# Altium project BenchSignalGenerator.PrjPcb (part 1 of 3)
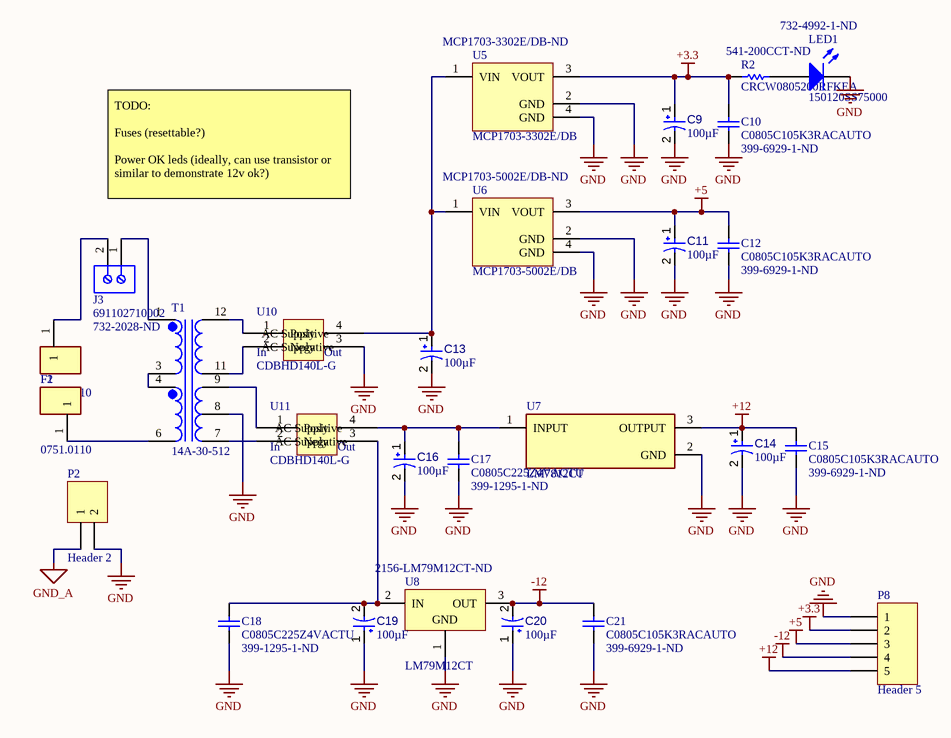
[diagram p0: Power.SchDoc]
4 sheets, 75 parts. Net scope: flat (ports and power ports of the same name join across sheets).
Board file: BenchSignalGenerator.PcbDoc
Sheets:
  Power.SchDoc
  AD9834.SchDoc
  MCU.SchDoc
  InputOutput.SchDoc

## Sheet Power.SchDoc
size A4

### Parts
C9  value 100µF  [CAPPR65-500-1600X1000X1700]  (hidden comment: ECA-2AM101)
C10  C0805C105K3RACAUTO  Supplier Part Number 1: 399-6929-1-ND  [CAPC2013X140X50ML20T25]
C11  value 100µF  [CAPPR65-500-1600X1000X1700]  (hidden comment: ECA-2AM101)
C12  C0805C105K3RACAUTO  Supplier Part Number 1: 399-6929-1-ND  [CAPC2013X140X50ML20T25]
C13  value 100µF  [CAPPR65-500-1600X1000X1700]  (hidden comment: ECA-2AM101)
C14  value 100µF  [CAPPR65-500-1600X1000X1700]  (hidden comment: ECA-2AM101)
C15  C0805C105K3RACAUTO  Supplier Part Number 1: 399-6929-1-ND  [CAPC2013X140X50ML20T25]
C16  value 100µF  [CAPPR65-500-1600X1000X1700]  (hidden comment: ECA-2AM101)
C17  C0805C225Z4VACTU  Supplier Part Number 1: 399-1295-1-ND  [CAPC2013X100X50NL20T25]
C18  C0805C225Z4VACTU  Supplier Part Number 1: 399-1295-1-ND  [CAPC2013X100X50NL20T25]
C19  value 100µF  [CAPPR65-500-1600X1000X1700]  (hidden comment: ECA-2AM101)
C20  value 100µF  [CAPPR65-500-1600X1000X1700]  (hidden comment: ECA-2AM101)
C21  C0805C105K3RACAUTO  Supplier Part Number 1: 399-6929-1-ND  [CAPC2013X140X50ML20T25]
F1  0751.0110  [FP-0751_0110-MFG]
F2  0751.0110  [FP-0751_0110-MFG]
J3  691102710002  Supplier Part Number 1: 732-2028-ND  [691102710002]
LED1  150120SS75000  Supplier Part Number 1: 732-4992-1-ND  [1206_A]
P2  Header 2  [HDR1X2]
P8  Header 5  [HDR1X5]
R2  CRCW0805200RFKEA  Supplier Part Number 1: 541-200CCT-ND  [RESC2013X50X30NL20T20]
T1  14A-30-512  [XFMR_14A-30-512]
U5  MCP1703-3302E/DB  Supplier Part Number 1: MCP1703-3302E/DB-ND  [SOT-223-DB3_M]
U6  MCP1703-5002E/DB  Supplier Part Number 1: MCP1703-5002E/DB-ND  [SOT-223-DB3_N]
U7  LM7812CT  [FP-TO220B03-MFG]
U8  LM79M12CT  Supplier Part Number 1: 2156-LM79M12CT-ND  [NDE0003A]
U10  CDBHD140L-G  [SOP270P700X290-4N]
U11  CDBHD140L-G  [SOP270P700X290-4N]

### Nets
+3.3: C9.1 C10.2 P8.2 R2.1 U5.3(VOUT)
+5: C11.1 C12.2 P8.3 U6.3(VOUT)
+12: C14.1 C15.2 P8.5 U7.3(OUTPUT)
-12: C20.2 C21.2 P8.4 U8.3(OUT)
GND: C9.2 C10.1 C11.2 C12.1 C13.2 C14.2 C15.1 C16.2 C17.1 C18.1 C19.1 C20.1 C21.1 LED1.1(K) P2.2 P8.1 T1.8 U5.2(GND) U5.4(GND) U6.2(GND) U6.4(GND) U7.2(GND) U8.1(GND) U10.3(AC_Supply)
GND_A: P2.1
NetC13_1: C13.1 U5.1(VIN) U6.1(VIN) U10.4(AC_Supply)
NetC16_1: C16.1 C17.2 U7.1(INPUT) U11.4(AC_Supply)
NetC18_2: C18.2 C19.2 U8.2(IN) U11.3(AC_Supply)
NetF1_1: F1.1 T1.6
NetF2_1: F2.1 J3.2
NetJ3_1: J3.1 T1.1
NetLED1_2: LED1.2(A) R2.2
NetT1_3: T1.3 T1.4
NetT1_7: T1.7 U11.2(Negative)
NetT1_9: T1.9 U11.1(Positive)
NetT1_11: T1.11 U10.2(Negative)
NetT1_12: T1.12 U10.1(Positive)

### Notes on the sheet
- TODO:
  Fuses (resettable?)
  Power OK leds (ideally, can use transistor or similar to demonstrate 12v ok?)
- (in symbol CMP-019-00049-1) In; Out

### Library data of the parts
C9 C11 C13 C14 C16 C19 C20 = CMP-001-00034-5: Aluminum Electrolytic Capacitor, 100 uF, +/- 20%, 100 V, -40 to 85 degC, 2-Pin THD, RoHS, Bulk; Manufacturer: Panasonic; Voltage Rating: 100V; Ripple Current (AC): 350mA; Mounting Technology: TH; RoHS Compliant: True; Package Reference: CAPPR65-500-1600X1000X1700; Lead Pitch: 5mm; Manufacturer URL: http://www.panasonic.com/; Min Operating Temperature: -40°C; Package Quantity: 200; Capacitor Type: Electrolytic; Diameter: 10mm; Packaging: Bulk; Datasheet URL: https://industrial.panasonic.com/cdbs/www-data/pdf/RDF0000/ABA0000C1047.pdf; Max Operating Temperature: 85°C; Pins: 2; Case/Package: Radial; Package Description: 2-Pin Through Hole Device, Dia 10 mm, Body Length 16 mm; Ripple Current: 350mA; Tolerance: 20%; Datasheet Version: Mar-16
C10 C12 C15 C21 = CMP-2007-03233-1: Manufacturer: Kemet; Dielectric Material: Ceramic; Capacitance: 1uF; Tolerance: 10%; Dielectric: X7R; Voltage Rating (DC): 25V; Part Number: C0805C105K3RACAUTO; Supplier 1: Digi-Key; Manufacturer Part Number: C0805C105K3RACAUTO; RoHS: Yes; Category: Ceramic Capacitors; Stock 1: 71727; Pricing 1: 1=0.18000, 10=0.12100, 50=0.07280, 100=0.06140, 500=0.04204, 1000=0.03719 (USD); Mount: Surface Mount; Case/Package: 0805; Case Code (Metric): 2012; Case Code (Imperial): 0805; Min Operating Temperature: -55°C; Max Operating Temperature: 125°C; Packaging: Cut Tape; Voltage Rating: 25V; Package Quantity: 1; Length: 2mm; Height: 1.25mm; Width: 0.049inch; Thickness: 0.055inch; Depth: 1.25mm; Ratings: AEC-Q200; Radiation Hardening: No; REACH SVHC: No SVHC; ComponentLink1URL: https://datasheet.ciiva.com/6074/1732735-6074357.pdf?src-supplier=Farnell; ComponentLink1Description: https://datasheet.ciiva.com/6074/1732735-6074357.pdf?src-supplier=Farnell; ComponentLink2URL: https://datasheet.ciiva.com/7842/1732735-7842186.pdf?src-supplier=Element14; ComponentLink2Description: https://datasheet.ciiva.com/7842/1732735-7842186.pdf?src-supplier=Element14
C17 C18 = CMP-2007-03689-1: Manufacturer: Kemet; Dielectric Material: Ceramic; Capacitance: 2.2uF; Tolerance: 80%; Voltage Rating (DC): 16V; Dielectric: Y5V; Part Number: C0805C225Z4VACTU; Supplier 1: Digi-Key; Manufacturer Part Number: C0805C225Z4VACTU; RoHS: Yes; Category: Ceramic Capacitors; Stock 1: 131695; Pricing 1: 1=0.20000, 10=0.13600, 50=0.08160, 100=0.06900, 500=0.04720, 1000=0.04175 (USD); Mount: Surface Mount; Case/Package: 0805; Case Code (Imperial): 0805; Case Code (Metric): 2012; Min Operating Temperature: -30°C; Max Operating Temperature: 85°C; Packaging: Tape and Reel; Voltage Rating: 16V; Termination: SMD/SMT; Package Quantity: 1; Voltage: 16V; Length: 2mm; Height: 0.9mm; Depth: 1.25mm; Width: 0.049inch; Thickness: 0.055inch; Lead Pitch: 0.75mm; Radiation Hardening: No; Lead Free: Lead Free; REACH SVHC: No SVHC; ComponentLink1URL: https://datasheet.ciiva.com/7842/1698780-7842295.pdf?src-supplier=Element14; ComponentLink1Description: https://datasheet.ciiva.com/7842/1698780-7842295.pdf?src-supplier=Element14; ComponentLink2URL: https://datasheet.ciiva.com/7842/1698780-7842296.pdf?src-supplier=Element14; ComponentLink2Description: https://datasheet.ciiva.com/7842/1698780-7842296.pdf?src-supplier=Element14; ComponentLink3URL: https://datasheet.ciiva.com/18102/getdatasheetpartid-63401-18102155.pdf?src-supplier=Verical; ComponentLink3Description: https://datasheet.ciiva.com/18102/getdatasheetpartid-63401-18102155.pdf?src-supplier=Verical
F1 F2 = CMP-26292-000006-1: FUSE CLIP CARTRIDGE 10A PCB; Manufacturer: Schurter; Conn Orientation: Horizontal; Voltage Rating Ac: 500V; Number Of Fuses: 1; ComponentLink2Description: Datasheet; ComponentLink2URL: https://us.schurter.com/bundles/snceschurter/epim/_ProdPool_/newDS/en/typ_OG__Clip__5x20.pdf; Package: 0; Device Class L1: Circuit Protection; Lead Free: Yes; RoHS: TRUE; Voltage Rating Dc: 500V; Device Class L3: unset; Ambient Temperature Range Low: -40°C; Manufacturer Part Number: 0751.0110; Device Class L2: Fuse Holders; Octopart: https://octopart.com/0751.0110-schurter-19402; Height: 8.9mm; Digikey Description: FUSE CLIP CARTRIDGE 10A PCB; Ambient Temperature Range High: +85°C; Category: Fuse; Fuse Current: 10A; Automotive: No
J3 = CMP-1502-03258-1: Series 102 - 5.00 mm Horizontal Entry Modular with Pressure Clamp WR-TBL, 2 pin; Manufacturer: Wurth Elektronik; Pin Number: 2; Pitch: 5.00mm; Plating: Steel; Current Rating: 15A; Voltage Rating: 300V; Number of Levels: 1; Wire/Cable Gauge: 22AWG; Wire Gauge (Min): 14AWG; Stripping Length: -6mm; Manufacturer URL: http://www.we-online.de; Mounting Technology: THT; Publisher: WurthElektronik; Packaging: Box; Package Reference: 691102710002; Datasheet URL: http://katalog.we-online.de/em/datasheet/6911027100xx.pdf; Operating Temperature: -40to105degC; Part Number: 691102710002; Supplier 1: Digi-Key; Manufacturer Part Number: 691102710002; RoHS: Yes; Category: Terminal Blocks; Stock 1: 832; Pricing 1: 1=0.69000, 10=0.61600, 50=0.53200, 100=0.48000 (USD); Mount: Through Hole; Contact Material: Brass; Color: Blue; Contact Plating: Tin; Housing Material: Nylon; Min Operating Temperature: -40°C; Max Operating Temperature: 105°C; Termination: Screw; Number of Contacts: 2; Package Quantity: 900; Number of Positions Per Level: 2; Current: 15A; Voltage: 300V; Length: 7.5mm; Height: 13.4mm; Width: 11.2mm; Wire Gauge (Max): 22AWG; REACH SVHC: Unknown; ComponentLink1URL: https://datasheet.ciiva.com/824/6911027100xx-824045.pdf?src-supplier=Digi-Key; ComponentLink1Description: https://datasheet.ciiva.com/824/6911027100xx-824045.pdf?src-supplier=Digi-Key; ComponentLink2URL: https://datasheet.ciiva.com/48686/001088592-da-01-en-wr-tbl-terminal-block102-691102710002-48686823.pdf?src-supplier=Conrad; ComponentLink2Description: https://datasheet.ciiva.com/48686/001088592-da-01-en-wr-tbl-terminal-block102-691102710002-48686823.pdf?src-supplier=Conrad
LED1 = CMP-1426-00017-1: SMD mono-color Chip LED, WL-SMCW, Super Red; Manufacturer: Wuerth Elektronik; Viewing Angle: 140°; Lens Style: Clear,Rectangular; Luminous Intensity: 60mcd; Forward Current: 30mA; Forward Voltage: 1.9V; Wavelength: 630nm; Test Current: 20mA; ComponentLink1URL: http://www.we-online.com; PackageReference: 1206_A; ComponentLink2Description: Datasheet; ComponentLink1Description: Manufacturer URL; ComponentLink2URL: http://katalog.we-online.com/led/datasheet/150120SS75000.pdf; Color: Super Red; PartNumber: 150120SS75000; Supplier 1: Digi-Key; Manufacturer Part Number: 150120SS75000; RoHS: Yes; Category: LEDs; Stock 1: 4278; Pricing 1: 1=0.21000, 50=0.19800, 100=0.17100, 500=0.14800 (USD); Mount: Surface Mount; Case/Package: 1206; Case Code (Metric): 3216; Case Code (Imperial): 1206; Min Operating Temperature: -40°C; Max Operating Temperature: 85°C; Package Quantity: 3000; Packaging: Tape and Reel; Dominant Wavelength: 630nm; Length: 3.2mm; Height: 0.68mm; Width: 1.6mm; REACH SVHC: Unknown; ComponentLink3URL: https://datasheet.ciiva.com/29561/150120ss75000-29561862.pdf?src-supplier=Digi-Key; ComponentLink3Description: https://datasheet.ciiva.com/29561/150120ss75000-29561862.pdf?src-supplier=Digi-Key; ComponentLink4URL: https://datasheet.ciiva.com/29279/759443-da-01-en-chipled-1206-w-kl-s-rot-150120ss75000-29279053.pdf?src-supplier=Conrad; ComponentLink4Description: https://datasheet.ciiva.com/29279/759443-da-01-en-chipled-1206-w-kl-s-rot-150120ss75000-29279053.pdf?src-supplier=Conrad; ComponentLink5URL: https://datasheet.ciiva.com/29561/150120ss75000-29561863.pdf?src-supplier=Digi-Key; ComponentLink5Description: https://datasheet.ciiva.com/29561/150120ss75000-29561863.pdf?src-supplier=Digi-Key; ComponentLink6URL: https://datasheet.ciiva.com/48430/150120ss75000-eng-tds-48430055.pdf?src-supplier=Distrelec; ComponentLink6Description: https://datasheet.ciiva.com/48430/150120ss75000-eng-tds-48430055.pdf?src-supplier=Distrelec; ComponentLink7URL: https://datasheet.ciiva.com/29561/150120ss75000-29561864.pdf?src-supplier=Digi-Key; ComponentLink7Description: https://datasheet.ciiva.com/29561/150120ss75000-29561864.pdf?src-supplier=Digi-Key
P2 = Header 2: Header, 2-Pin; LatestRevisionDate: 17-Jul-2002; LatestRevisionNote: Re-released for DXP Platform.; Publisher: Altium Limited
P8 = Header 5: Header, 5-Pin; LatestRevisionDate: 17-Jul-2002; LatestRevisionNote: Re-released for DXP Platform.; Publisher: Altium Limited
R2 = CMP-2001-03663-1: Manufacturer: Vishay Dale; Resistance: 200R; Tolerance: 1%; Temperature Coefficient: 100ppm/°C; Power Rating: 125mW; Voltage Rating: 150V; Part Number: CRCW0805200RFKEA; Supplier 1: Digi-Key; Manufacturer Part Number: CRCW0805200RFKEA; RoHS: Yes; Category: Chip SMD Resistors; Stock 1: 97163; Pricing 1: 1=0.10000, 10=0.06000, 100=0.02450, 1000=0.01102, 2500=0.00957 (USD); Mount: Surface Mount; Case/Package: 0805; Number of Pins: 2; Weight: 0.000194oz; Case Code (Metric): 2012; Case Code (Imperial): 0805; Contact Plating: Tin; Min Operating Temperature: -55°C; Max Operating Temperature: 155°C; Packaging: Tape and Reel; Termination: SMD/SMT; Composition: Thick Film; Voltage Rating (DC): 150V; Package Quantity: 10; Number of Terminations: 2; Military Standard: Not; Max Power Dissipation: 125mW; Features: Automotive AEC-Q200; Working Voltage: 150V; Length: 2mm; Height: 0.45mm; Width: 0.049inch; Depth: 1.25mm; Radiation Hardening: No; REACH SVHC: Unknown; Lead Free: Lead Free; ComponentLink1URL: https://datasheet.ciiva.com/11809/0900766b80d98b26-11809981.pdf?src-supplier=RSComponents; ComponentLink1Description: https://datasheet.ciiva.com/11809/0900766b80d98b26-11809981.pdf?src-supplier=RSComponents; ComponentLink2URL: https://datasheet.ciiva.com/2467/dcrcwe3-2467524.pdf?src-supplier=Digi-Key; ComponentLink2Description: https://datasheet.ciiva.com/2467/dcrcwe3-2467524.pdf?src-supplier=Digi-Key; ComponentLink3URL: https://datasheet.ciiva.com/2467/dcrcwe3-2467525.pdf?src-supplier=Digi-Key; ComponentLink3Description: https://datasheet.ciiva.com/2467/dcrcwe3-2467525.pdf?src-supplier=Digi-Key; ComponentLink4URL: https://datasheet.ciiva.com/17167/dcrcwe3-17167157.pdf?src-supplier=Avnet+Europe; ComponentLink4Description: https://datasheet.ciiva.com/17167/dcrcwe3-17167157.pdf?src-supplier=Avnet+Europe; ComponentLink5URL: https://datasheet.ciiva.com/2467/dcrcwe3-2467526.pdf?src-supplier=Digi-Key; ComponentLink5Description: https://datasheet.ciiva.com/2467/dcrcwe3-2467526.pdf?src-supplier=Digi-Key; ComponentLink6URL: https://datasheet.ciiva.com/7673/1697337-7673478.pdf?src-supplier=Element14; ComponentLink6Description: https://datasheet.ciiva.com/7673/1697337-7673478.pdf?src-supplier=Element14; ComponentLink7URL: https://datasheet.ciiva.com/16755/70201119-16755607.pdf?src-supplier=Allied+Electronics; ComponentLink7Description: https://datasheet.ciiva.com/16755/70201119-16755607.pdf?src-supplier=Allied+Electronics; ComponentLink8URL: https://datasheet.ciiva.com/7673/1697337-7673336.pdf?src-supplier=Element14; ComponentLink8Description: https://datasheet.ciiva.com/7673/1697337-7673336.pdf?src-supplier=Element14; ComponentLink9URL: https://datasheet.ciiva.com/5542/dcrcwe3-109170-5542762.pdf?src-supplier=Mouser; ComponentLink9Description: https://datasheet.ciiva.com/5542/dcrcwe3-109170-5542762.pdf?src-supplier=Mouser; ComponentLink10URL: https://datasheet.ciiva.com/26317/fld-crcw-e3-data-en-26317339.pdf?src-supplier=Distrelec; ComponentLink10Description: https://datasheet.ciiva.com/26317/fld-crcw-e3-data-en-26317339.pdf?src-supplier=Distrelec; ComponentLink11URL: https://datasheet.ciiva.com/3258/dcrcwe3-3258302.pdf?src-supplier=Avnet; ComponentLink11Description: https://datasheet.ciiva.com/3258/dcrcwe3-3258302.pdf?src-supplier=Avnet; ComponentLink12URL: https://datasheet.ciiva.com/16199/dcrcwe3-16199471.pdf?src-supplier=Future+Electronics; ComponentLink12Description: https://datasheet.ciiva.com/16199/dcrcwe3-16199471.pdf?src-supplier=Future+Electronics; ComponentLink13URL: https://datasheet.ciiva.com/16786/70201119-16786975.pdf?src-supplier=Allied+Electronics; ComponentLink13Description: https://datasheet.ciiva.com/16786/70201119-16786975.pdf?src-supplier=Allied+Electronics
T1 = 14A-30-512: International One-4-All Triple Output Transformer; Value: *
U5 = CMP-0136-00514-1: 250 mA, 16V, Low Quiescent Current LDO Regulator, 3-Pin SOT-223, Extended Temperature; Manufacturer: Microchip; Min Input Voltage: 2.7V; Output Voltage: 3.3V; Dropout Voltage: 525mV; Output Current: 250mA; Output Type: Fixed; Number of Outputs: 1; Quiescent Current: 5uA; Polarity: Positive; Accuracy: 2%; Input Bias Current: 2uA; PackageReference: SOT-223-DB3; DatasheetVersion: revD, Sep-2009; PackageVersion: revBB, Aug-2009; PackageDescription: 3-Lead Plastic Small Outline Transistor (DB) [SOT-223]; Supplier 1: Digi-Key; Manufacturer Part Number: MCP1703-3302E/DB; RoHS: Yes; Category: Voltage Regulators - Linear; Stock 1: 2370; Pricing 1: 1=0.62000, 25=0.52000, 100=0.47000 (USD); Mount: Surface Mount; Case/Package: SOT-223; Number of Pins: 3; Contact Plating: Tin,Matte; Min Operating Temperature: -40°C; Max Operating Temperature: 125°C; Packaging: Rail/Tube; Max Input Voltage: 16V; Max Output Current: 250mA; Min Output Voltage: 3.3V; Package Quantity: 78; Output Voltage Accuracy: 2%; Nominal Output Voltage: 3.3V; Length: 6.5mm; Height: 1.6mm; Width: 3.5mm; Radiation Hardening: No; Lead Free: Lead Free; REACH SVHC: No SVHC; ComponentLink1URL: https://datasheet.ciiva.com/3224/jp530937-3224135.pdf?src-supplier=Avnet; ComponentLink1Description: https://datasheet.ciiva.com/3224/jp530937-3224135.pdf?src-supplier=Avnet; ComponentLink2URL: https://datasheet.ciiva.com/8041/22049f-8041354.pdf?src-supplier=Element14; ComponentLink2Description: https://datasheet.ciiva.com/8041/22049f-8041354.pdf?src-supplier=Element14; ComponentLink3URL: https://datasheet.ciiva.com/15200/getdatasheetpartid-771601-15200250.pdf?src-supplier=Verical; ComponentLink3Description: https://datasheet.ciiva.com/15200/getdatasheetpartid-771601-15200250.pdf?src-supplier=Verical; ComponentLink4URL: https://datasheet.ciiva.com/2057/22049f-2057211.pdf?src-supplier=Digi-Key; ComponentLink4Description: https://datasheet.ciiva.com/2057/22049f-2057211.pdf?src-supplier=Digi-Key; ComponentLink5URL: https://datasheet.ciiva.com/29305/651421-da-01-en-ic-reg-ld-mcp1703-3302e-db-sot-223-3-mcp-29305285.pdf?src-supplier=Conrad; ComponentLink5Description: https://datasheet.ciiva.com/29305/651421-da-01-en-ic-reg-ld-mcp1703-3302e-db-sot-223-3-mcp-29305285.pdf?src-supplier=Conrad
U6 = CMP-0136-00522-1: 250 mA, 16V, Low Quiescent Current LDO Regulator, 3-Pin SOT-223, Extended Temperature; Manufacturer: Microchip; Output Voltage: 5V; Min Input Voltage: 2.7V; Dropout Voltage: 330mV; Output Current: 250mA; Output Type: Fixed; Number of Outputs: 1; Polarity: Positive; Quiescent Current: 5uA; Accuracy: 2%; Input Bias Current: 2uA; PackageReference: SOT-223-DB3; PackageVersion: revBB, Aug-2009; DatasheetVersion: revD, Sep-2009; PackageDescription: 3-Lead Plastic Small Outline Transistor (DB) [SOT-223]; Supplier 1: Digi-Key; Manufacturer Part Number: MCP1703-5002E/DB; RoHS: Yes; Category: Voltage Regulators - Linear; Stock 1: 5236; Pricing 1: 1=0.62000, 25=0.52000, 100=0.47000 (USD); Mount: Surface Mount; Case/Package: SOT-223; Number of Pins: 3; Min Operating Temperature: -40°C; Max Operating Temperature: 125°C; Packaging: Rail/Tube; Max Input Voltage: 16V; Max Output Current: 250mA; Min Output Voltage: 5V; Package Quantity: 78; Output Voltage Accuracy: 2%; Nominal Output Voltage: 5V; Length: 6.5mm; Height: 1.6mm; Width: 3.5mm; Radiation Hardening: No; Lead Free: Lead Free; REACH SVHC: No SVHC; ComponentLink1URL: https://datasheet.ciiva.com/41458/001085888-da-01-en-ic-reg-ld-mcp1703-5002e-db-sot-223-3-mcp-41458871.pdf?src-supplier=Conrad; ComponentLink1Description: https://datasheet.ciiva.com/41458/001085888-da-01-en-ic-reg-ld-mcp1703-5002e-db-sot-223-3-mcp-41458871.pdf?src-supplier=Conrad; ComponentLink2URL: https://datasheet.ciiva.com/2041/22049f-2041046.pdf?src-supplier=Digi-Key; ComponentLink2Description: https://datasheet.ciiva.com/2041/22049f-2041046.pdf?src-supplier=Digi-Key; ComponentLink3URL: https://datasheet.ciiva.com/3224/jp530937-3224136.pdf?src-supplier=Avnet; ComponentLink3Description: https://datasheet.ciiva.com/3224/jp530937-3224136.pdf?src-supplier=Avnet; ComponentLink4URL: https://datasheet.ciiva.com/8041/22049f-8041355.pdf?src-supplier=Element14; ComponentLink4Description: https://datasheet.ciiva.com/8041/22049f-8041355.pdf?src-supplier=Element14; ComponentLink5URL: https://datasheet.ciiva.com/15200/getdatasheetpartid-626576-15200251.pdf?src-supplier=Verical; ComponentLink5Description: https://datasheet.ciiva.com/15200/getdatasheetpartid-626576-15200251.pdf?src-supplier=Verical; ComponentLink6URL: https://datasheet.ciiva.com/16373/filehandler-aspxddocname-en530937-16373582.pdf?src-supplier=Future+Electronics; ComponentLink6Description: https://datasheet.ciiva.com/16373/filehandler-aspxddocname-en530937-16373582.pdf?src-supplier=Future+Electronics; ComponentLink7URL: https://datasheet.ciiva.com/22629/22049f-22629247.pdf?src-supplier=Farnell; ComponentLink7Description: https://datasheet.ciiva.com/22629/22049f-22629247.pdf?src-supplier=Farnell
U7 = CMP-07128-000015-1: IC REG LINEAR 12V 1A TO220-3; Obsolete Part: true; Manufacturer: ON Semiconductor; Nominal Supply Current: 5.1mA; Output Type: Fixed; Dropout Voltage: 2V; Max Supply Voltage: 35V; Accuracy Percentage: 4%; Standoff Height: 2.7mm; Number Of Outputs: 1; Octopart: https://octopart.com/lm7812ct-on+semiconductor-14383031; Output Current: 1A; ComponentLink2Description: Datasheet; Device Class L1: Integrated Circuits (ICs); Device Class L2: Power Management ICs; Temperature Range Low: -40°C; Category: IC; Package: TO220B03; Device Class L3: Voltage Regulators - Linear; RoHS: TRUE; Digikey Description: IC REG LINEAR 12V 1A TO220-3; Ipc Land Pattern Name: TO-220; Output Voltage: 12V; Temperature: -40°C to +125°C; Automotive: No; Temperature Range High: +125°C; ComponentLink2URL: https://www.mouser.in/datasheet/2/308/LM7812-1125088.pdf; Manufacturer Part Number: LM7812CT; Height: 20.4mm; Lead Free: Yes
U8 = CMP-0062-02499-3: 3-Terminal Negative Regulators, 3-pin TO-220; Manufacturer: Texas Instruments; PackageTopMarking: NSUZXYTTE#*LM79M*12CT; PowerWise: N; CompType: LDO IC; Dropout Voltage: 1.1V; Number of Outputs: 1; Output Voltage: -12V; Output Current: 500mA; Max Input Voltage: -35V; Min Input Voltage: -14.5V; Quiescent Current: 3mA; Output Type: Fixed; Accuracy: 4%; PackageDescription: TO-220, Molded, 3 Lead, Straight; ComponentLink1Description: Datasheet URL; PinCount: 3; RoHS: N; ComponentLink1URL: http://www.ti.com/general/docs/lit/getliterature.tsp?genericPartNumber=LM79M12&fileType=pdf; PackageReference: NDE0003A; Supplier 1: Digi-Key; Manufacturer Part Number: LM79M12CT; Category: Voltage Regulators - Linear; Stock 1: 430; Pricing 1: 358=250.60000 (USD); Mount: Through Hole; Case/Package: TO-220; Number of Pins: 3; Packaging: Rail/Tube; Max Output Current: 500mA; Package Quantity: 45; Polarity: Negative; Number of Regulators: 1; Output Voltage Accuracy: 4%; Current Rating: 500mA; Radiation Hardening: No; Lead Free: Contains Lead; ComponentLink2URL: https://datasheet.ciiva.com/3225/lm79m12-3225442.pdf?src-supplier=Avnet; ComponentLink2Description: https://datasheet.ciiva.com/3225/lm79m12-3225442.pdf?src-supplier=Avnet; ComponentLink3URL: https://datasheet.ciiva.com/6583/lm79m05-6583721.pdf?src-supplier=Digi-Key; ComponentLink3Description: https://datasheet.ciiva.com/6583/lm79m05-6583721.pdf?src-supplier=Digi-Key; ComponentLink4URL: https://datasheet.ciiva.com/15111/getdatasheetpartid-55274-15111210.pdf?src-supplier=Verical; ComponentLink4Description: https://datasheet.ciiva.com/15111/getdatasheetpartid-55274-15111210.pdf?src-supplier=Verical
U10 U11 = CMP-019-00049-1: DIODE SCHOTTKY 1A 40V TO-269AA; Max Surge Current: 30A; Max Reverse Leakage Current: 5mA; Mount: Surface Mount; Packaging: Tape and Reel; Package Quantity: 2500